# Altium schematic sheet [03] MCU.SchDoc
size A
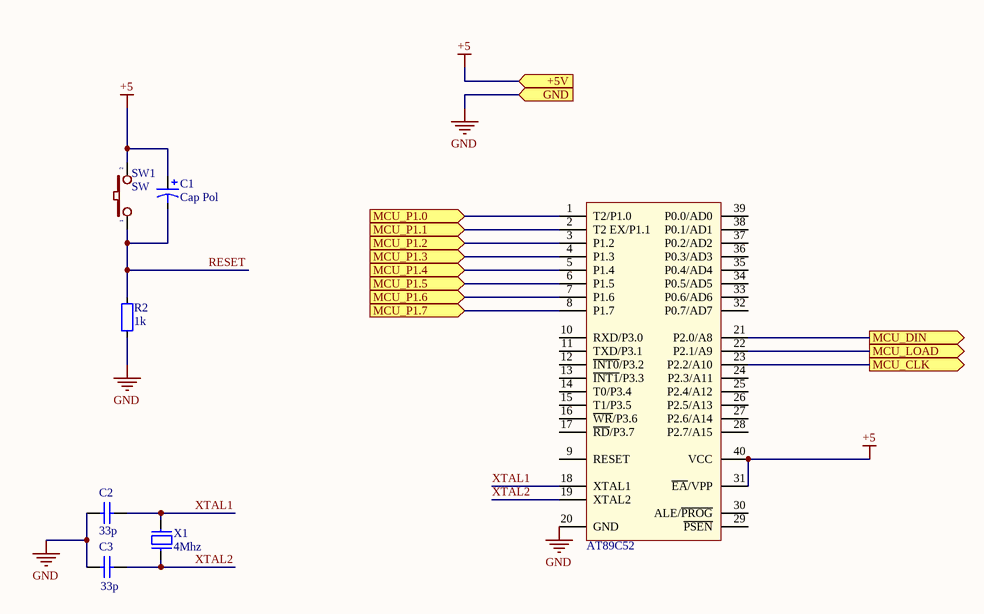
[diagram p0: [03] MCU.SchDoc]

## Parts
C1  Cap Pol  [C3MM]
C2  value 33p  [CAP_CERAMIC]  (hidden comment: Capacitor Ceramic)
C3  value 33p  [CAP_CERAMIC]  (hidden comment: Capacitor Ceramic)
IC1  AT89C52  [DIP40/W0.6]
R2  1k  [RES-1/2W]
SW1  SW  [SW2]
X1  4Mhz  [XT2]

## Ports
+5V (in), GND (in), MCU_CLK (out), MCU_DIN (out), MCU_LOAD (out), MCU_P1.0 (in), MCU_P1.1 (in), MCU_P1.2 (in), MCU_P1.3 (in), MCU_P1.4 (in), MCU_P1.5 (in), MCU_P1.6 (in), MCU_P1.7 (in)

## Nets
+5: C1.1 IC1.31(~{EA}/VPP) IC1.40(VCC) SW1.2 ; port +5V
GND: C2.1 C3.1 IC1.20(GND) R2.1 ; port GND
MCU_CLK: IC1.23(P2.2/A10) ; port MCU_CLK
MCU_DIN: IC1.21(P2.0/A8) ; port MCU_DIN
MCU_LOAD: IC1.22(P2.1/A9) ; port MCU_LOAD
MCU_P1.0: IC1.1(T2/P1.0) ; port MCU_P1.0
MCU_P1.1: IC1.2(T2_EX/P1.1) ; port MCU_P1.1
MCU_P1.2: IC1.3(P1.2) ; port MCU_P1.2
MCU_P1.3: IC1.4(P1.3) ; port MCU_P1.3
MCU_P1.4: IC1.5(P1.4) ; port MCU_P1.4
MCU_P1.5: IC1.6(P1.5) ; port MCU_P1.5
MCU_P1.6: IC1.7(P1.6) ; port MCU_P1.6
MCU_P1.7: IC1.8(P1.7) ; port MCU_P1.7
RESET: C1.2 R2.2 SW1.1
XTAL1: C2.2 IC1.18(XTAL1) X1.2
XTAL2: C3.2 IC1.19(XTAL2) X1.1

Not connected (* = marked no-connect by the designer): IC1 9(RESET) 10(RXD/P3.0) 11(TXD/P3.1) 12(~{INT0}/P3.2) 13(~{INT1}/P3.3) 14(T0/P3.4) 15(T1/P3.5) 16(~{WR}/P3.6) 17(~{RD}/P3.7) 24(P2.3/A11) 25(P2.4/A12) 26(P2.5/A13) 27(P2.6/A14) 28(P2.7/A15) 29(~{PSEN}) 30(ALE/~{PROG}) 32(P0.7/AD7) 33(P0.6/AD6) 34(P0.5/AD5) 35(P0.4/AD4) 36(P0.3/AD3) 37(P0.2/AD2) 38(P0.1/AD1) 39(P0.0/AD0)

## Library data of the parts
C1 = Cap Pol: Polarized Capacitor (Axial); Published: 8-Jun-2000; LatestRevisionDate: 17-Jul-2002; LatestRevisionNote: Re-released for DXP Platform.; PackageReference: POLAR0.8; Publisher: Altium Limited
C2 C3 = CapCeramic: Capacitor; Published: 8-Jun-2000; LatestRevisionDate: 17-Jul-2002; LatestRevisionNote: Re-released for DXP Platform.; PackageReference: RAD-0.3; Publisher: Altium Limited
IC1 = AT89C52: Atmel AT89C52, 8k Byte Flash Memory , 40 Pin; Value: AT89C52
R2 = Resistor - DIP: Value: R1/4W - 1K
SW1 = SW2: Switch button 2 pin; Value: SW chip 2 pin
X1 = XT2: Crystal For all Crystal 2pin.; Value: 4Mhz